# EAGLE board zx80 SD_12 (smd) build003 (EAGLE 9.6.2), part 1 of 2
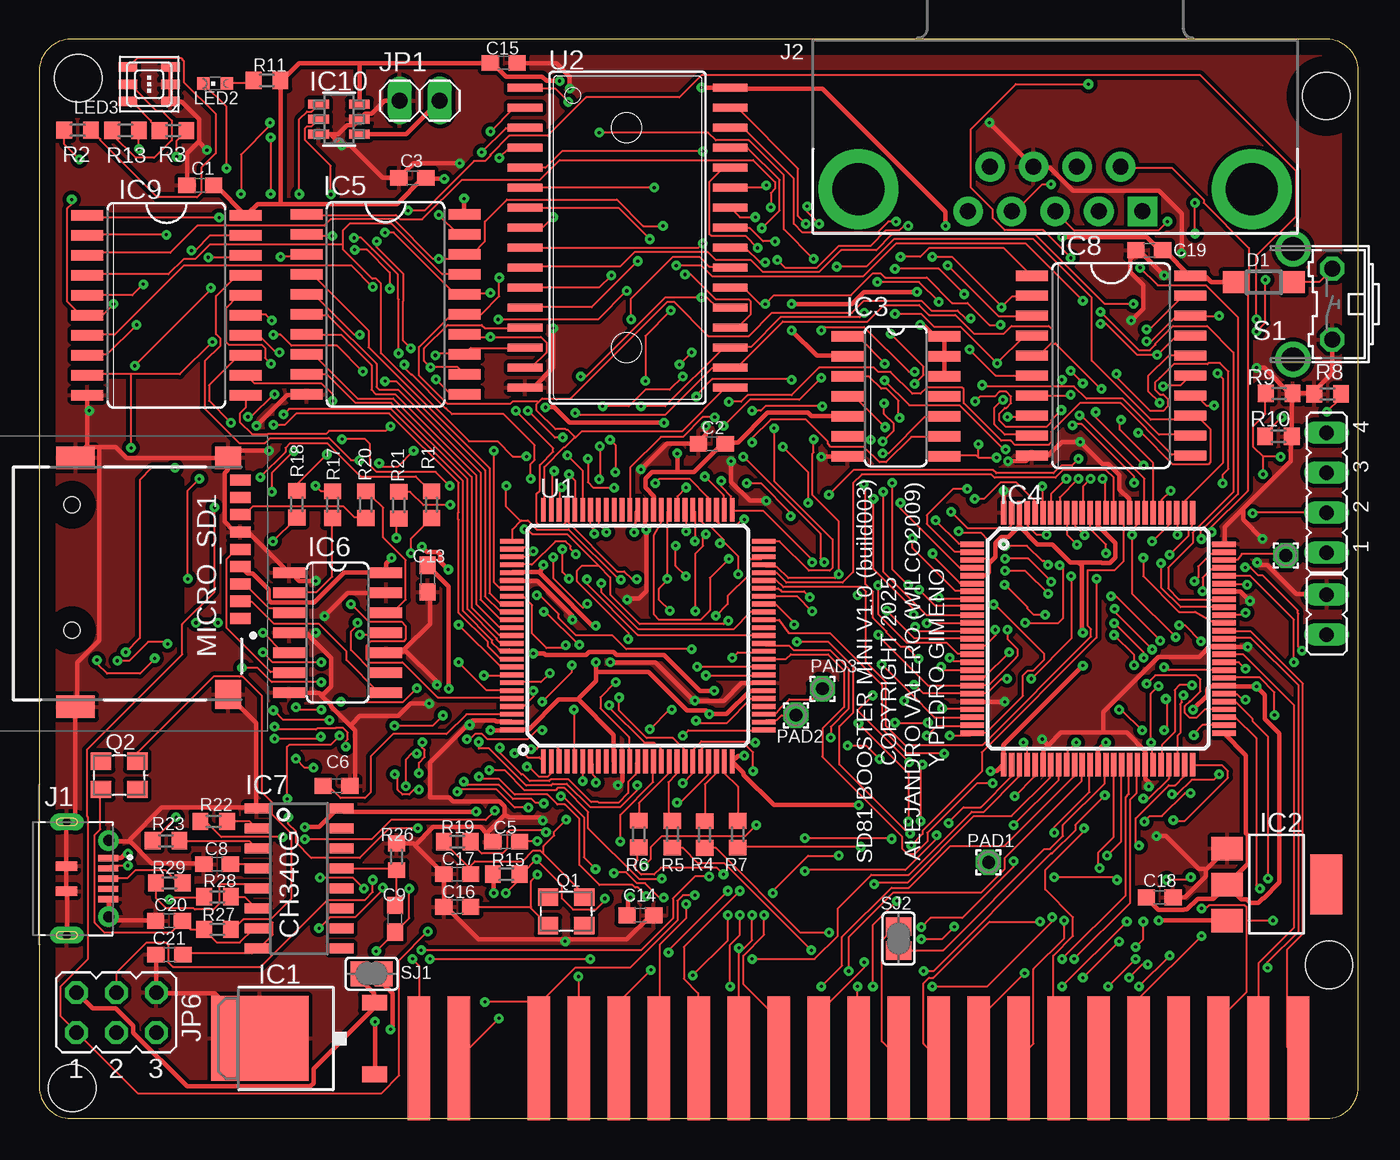
[diagram p3: board, top side]
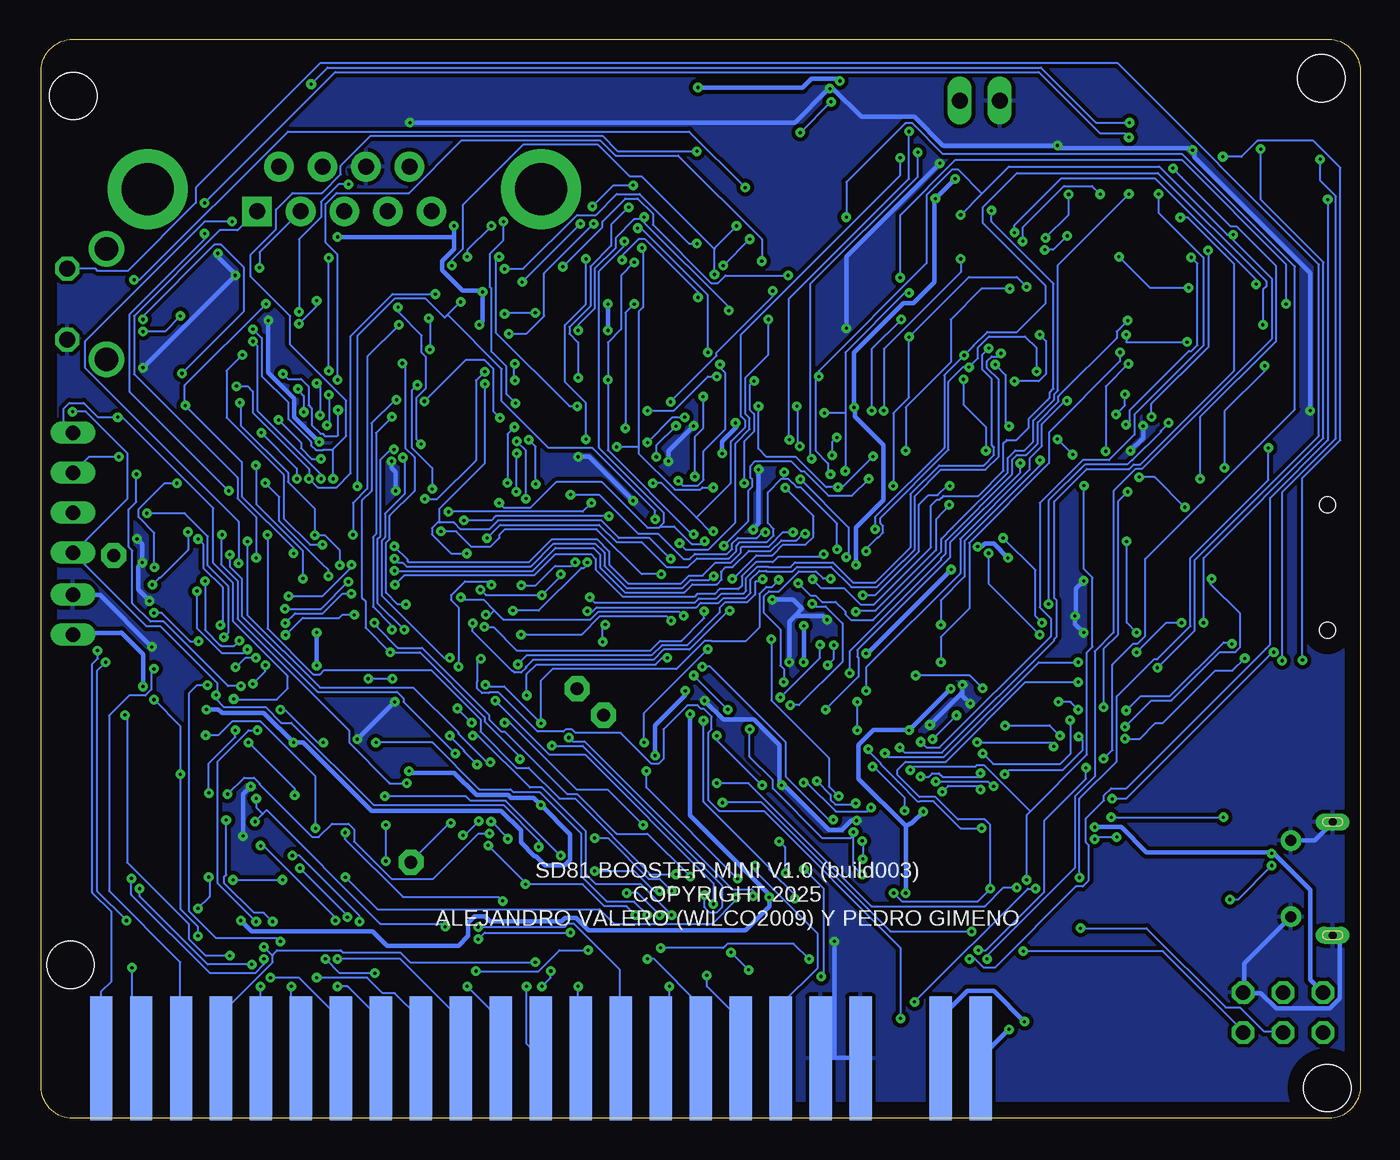
[diagram p4: board, bottom side, seen from below]

Size 83.82 x 68.58 mm. Coordinates in mm from the lower left corner, seen from the top.
Outline: 2,0 81.82,0 arc90 83.82,2 83.82,66.58 arc90 81.82,68.58 2,68.58 arc90 0,66.58 0,2 arc90 2,0
Copper layers (1*16): Top 0.035mm / dielectric 1.5mm / Bottom 0.035mm
Design rules "default *": minimum track width 5mil, minimum drill 0.2mm, track to track 6mil, track to pad 6mil, pad to pad 6mil, via to via 6mil, smd to smd 6mil, copper to edge 40mil, drill to drill 6mil, minimum pad ring 10mil, minimum via ring 8mil, stop-mask expansion 4mil, vias tented up to drill 999mil, thermal gap 10mil
Net classes: 1 VCC: width 0.3 mm; 2 3,3: width 0.3 mm
Holes 3 mm at 2.09,1.93 2.46,66.1 81.79,64.98 81.96,9.75

## Footprints (pad centres in the part's own frame; a part is rotated, then mirrored left to right if it is on the bottom)
EDGEPIN = smd 1.422 x 7.874: 1 0,0
C0603 = smd 1.1 x 1: 1 -0.85,0; 2 0.85,0
SOD123 = smd 1.4 x 1.4: A 1.9,0; C -1.9,0
TO252 = smd 1 x 1.6: 1 -2.28,-4.8; 2 2.28,-4.8 | smd 5.4 x 6.2: 3 0,2.5
SOT223 = smd 1.499 x 2.007: 1 -2.261,-3.15; 2 0.025,-3.15; 3 2.311,-3.15 | smd 3.81 x 2.007: 4 0,3.15
SO14 = smd 0.66 x 2.032: 1 -3.81,-3.073; 2 -2.54,-3.073; 3 -1.27,-3.073; 4 0,-3.073; 5 1.27,-3.073; 6 2.54,-3.073; 7 3.81,-3.073; 8 3.81,3.073; 9 2.54,3.073; 10 1.27,3.073; 11 0,3.073; 12 -1.27,3.073; 13 -2.54,3.073; 14 -3.81,3.073
TQFP100 = smd 1.5 x 0.345: 1 -8,6; 2 -8,5.5; 3 -8,5; 4 -8,4.5; 5 -8,4; 6 -8,3.5; 7 -8,3; 8 -8,2.5; 9 -8,2; 10 -8,1.5; 11 -8,1; 12 -8,0.5; 13 -8,0; 14 -8,-0.5; 15 -8,-1; 16 -8,-1.5; 17 -8,-2; 18 -8,-2.5; 19 -8,-3; 20 -8,-3.5; 21 -8,-4; 22 -8,-4.5; 23 -8,-5; 24 -8,-5.5; 25 -8,-6; 51 8,-6; 52 8,-5.5; 53 8,-5; 54 8,-4.5; 55 8,-4; 56 8,-3.5; 57 8,-3; 58 8,-2.5; 59 8,-2; 60 8,-1.5; 61 8,-1; 62 8,-0.5; 63 8,0; 64 8,0.5; 65 8,1; 66 8,1.5; 67 8,2; 68 8,2.5; 69 8,3; 70 8,3.5; 71 8,4; 72 8,4.5; 73 8,5; 74 8,5.5; 75 8,6 | smd 0.345 x 1.5: 26 -6,-8; 27 -5.5,-8; 28 -5,-8; 29 -4.5,-8; 30 -4,-8; 31 -3.5,-8; 32 -3,-8; 33 -2.5,-8; 34 -2,-8; 35 -1.5,-8; 36 -1,-8; 37 -0.5,-8; 38 0,-8; 39 0.5,-8; 40 1,-8; 41 1.5,-8; 42 2,-8; 43 2.5,-8; 44 3,-8; 45 3.5,-8; 46 4,-8; 47 4.5,-8; 48 5,-8; 49 5.5,-8; 50 6,-8; 76 6,8; 77 5.5,8; 78 5,8; 79 4.5,8; 80 4,8; 81 3.5,8; 82 3,8; 83 2.5,8; 84 2,8; 85 1.5,8; 86 1,8; 87 0.5,8; 88 0,8; 89 -0.5,8; 90 -1,8; 91 -1.5,8; 92 -2,8; 93 -2.5,8; 94 -3,8; 95 -3.5,8; 96 -4,8; 97 -4.5,8; 98 -5,8; 99 -5.5,8; 100 -6,8
SO20W = smd 0.66 x 2.032: 1 -5.715,-5.029; 2 -4.445,-5.029; 3 -3.175,-5.029; 4 -1.905,-5.029; 5 -0.635,-5.029; 6 0.635,-5.029; 7 1.905,-5.029; 8 3.175,-5.029; 9 4.445,-5.029; 10 5.715,-5.029; 11 5.715,5.029; 12 4.445,5.029; 13 3.175,5.029; 14 1.905,5.029; 15 0.635,5.029; 16 -0.635,5.029; 17 -1.905,5.029; 18 -3.175,5.029; 19 -4.445,5.029; 20 -5.715,5.029
SOIC16 = smd 0.635 x 1.524: 1 -4.445,-2.695; 2 -3.175,-2.695; 3 -1.905,-2.695; 4 -0.635,-2.695; 5 0.635,-2.695; 6 1.905,-2.695; 7 3.175,-2.695; 8 4.445,-2.695; 9 4.445,2.695; 10 3.175,2.695; 11 1.905,2.695; 12 0.635,2.695; 13 -0.635,2.695; 14 -1.905,2.695; 15 -3.175,2.695; 16 -4.445,2.695
SOT-23-6_MC = smd 1.321 x 0.559: 1 -1.295,0.95; 2 -1.295,0; 3 -1.295,-0.95; 4 1.295,-0.95; 5 1.295,0; 6 1.295,0.95
SHOUHAN_MICROXNJ = smd 0.4 x 1.25: 1 1.3,-4.375; 2 0.65,-4.375; 3 0,-4.375; 4 -0.65,-4.375; 5 -1.3,-4.375 | smd 0.6 x 1.35: S1 -0.8,-1.725; S2 0.8,-1.725 | drill 0.5 pad 1.07 long: S3 -3.6,-1.75; S6 3.6,-1.75 | drill 0.7 pad 1.3: S4 -2.425,-4.4; S5 2.425,-4.4
DB9_MALE = drill 1.016 pad 1.88 square: 1 5.54,-1.42 | drill 1.016 pad 1.88: 2 2.77,-1.42; 3 0,-1.42; 4 -2.77,-1.42; 5 -5.54,-1.42; 6 4.15,1.42; 7 1.38,1.42; 8 -1.38,1.42; 9 -4.15,1.42 | drill 3.302 pad 5.08: G1 -12.5,0; G2 12.5,0
1X02 = drill 1.016 long: 1 -1.27,0; 2 1.27,0
JP1 = drill 0.914 long: 1 0,-1.27; 2 0,1.27
JP4 = drill 0.914 long: 1 -3.81,0; 2 -1.27,0; 3 1.27,0; 4 3.81,0
JP3Q = drill 0.914 octagon: 1 -2.54,-1.27; 2 -2.54,1.27; 3 0,-1.27; 4 0,1.27; 5 2.54,-1.27; 6 2.54,1.27
CHIPLED_0603 = smd 0.8 x 0.8: A 0,-0.75; C 0,0.75
3535-PLCC6 = smd 1.2 x 0.6: P1 1.35,-1.1; P2 1.35,0; P3 1.35,1.1; P4 -1.35,1.1; P5 -1.35,0; P6 -1.35,-1.1
TF-01A = smd 0.7 x 1.3: 1 2.23,7.174; 2 1.13,7.174; 3 0.03,7.174; 4 -1.07,7.174; 5 -2.17,7.174; 6 -3.27,7.174; 7 -4.37,7.174; 8 -5.47,7.174; CD1 -6.57,7.174 | smd 1.448 x 1.651: MP1 -7.989,6.4 | smd 1.448 x 2.438: MP2 -7.989,-3.3; MP3 7.836,-3.3 | smd 1.854 x 1.651: MP4 7.061,6.4 | hole 1: -5.004,-3.531; 2.972,-3.531
1,6/0,8 = drill 0.813 pad 1.6 octagon: 1 0,0
3.2X2.5_KX-7 = smd 1.3 x 1.1: 1 -1.15,-0.9; 2 1.15,-0.9; 3 1.15,0.9; 4 -1.15,0.9
R0603 = smd 1 x 1.1: 1 -0.85,0; 2 0.85,0
B3F-31XX = drill 1.016 octagon: 1 -2.261,-1.245; 2 2.261,-1.245 | drill 1.499 pad 2.159: 3 -3.505,1.245; 4 3.505,1.245
SJ = smd 1.168 x 1.6: 1 -0.762,0; 2 0.762,0
TQFP100' = smd 1.5 x 0.3: 1 -8,6; 2 -8,5.5; 3 -8,5; 4 -8,4.5; 5 -8,4; 6 -8,3.5; 7 -8,3; 8 -8,2.5; 9 -8,2; 10 -8,1.5; 11 -8,1; 12 -8,0.5; 13 -8,0; 14 -8,-0.5; 15 -8,-1; 16 -8,-1.5; 17 -8,-2; 18 -8,-2.5; 19 -8,-3; 20 -8,-3.5; 21 -8,-4; 22 -8,-4.5; 23 -8,-5; 24 -8,-5.5; 25 -8,-6; 51 8,-6; 52 8,-5.5; 53 8,-5; 54 8,-4.5; 55 8,-4; 56 8,-3.5; 57 8,-3; 58 8,-2.5; 59 8,-2; 60 8,-1.5; 61 8,-1; 62 8,-0.5; 63 8,0; 64 8,0.5; 65 8,1; 66 8,1.5; 67 8,2; 68 8,2.5; 69 8,3; 70 8,3.5; 71 8,4; 72 8,4.5; 73 8,5; 74 8,5.5; 75 8,6 | smd 0.3 x 1.5: 26 -6,-8; 27 -5.5,-8; 28 -5,-8; 29 -4.5,-8; 30 -4,-8; 31 -3.5,-8; 32 -3,-8; 33 -2.5,-8; 34 -2,-8; 35 -1.5,-8; 36 -1,-8; 37 -0.5,-8; 38 0,-8; 39 0.5,-8; 40 1,-8; 41 1.5,-8; 42 2,-8; 43 2.5,-8; 44 3,-8; 45 3.5,-8; 46 4,-8; 47 4.5,-8; 48 5,-8; 49 5.5,-8; 50 6,-8; 76 6,8; 77 5.5,8; 78 5,8; 79 4.5,8; 80 4,8; 81 3.5,8; 82 3,8; 83 2.5,8; 84 2,8; 85 1.5,8; 86 1,8; 87 0.5,8; 88 0,8; 89 -0.5,8; 90 -1,8; 91 -1.5,8; 92 -2,8; 93 -2.5,8; 94 -3,8; 95 -3.5,8; 96 -4,8; 97 -4.5,8; 98 -5,8; 99 -5.5,8; 100 -6,8
SOP32-5 = smd 2.2 x 0.5: 1 -6.516,9.525; 2 -6.516,8.255; 3 -6.516,6.985; 4 -6.516,5.715; 5 -6.516,4.445; 6 -6.516,3.175; 7 -6.516,1.905; 8 -6.516,0.635; 9 -6.516,-0.635; 10 -6.516,-1.905; 11 -6.516,-3.175; 12 -6.516,-4.445; 13 -6.516,-5.715; 14 -6.516,-6.985; 15 -6.516,-8.255; 16 -6.516,-9.525; 17 6.516,-9.525; 18 6.516,-8.255; 19 6.516,-6.985; 20 6.516,-5.715; 21 6.516,-4.445; 22 6.516,-3.175; 23 6.516,-1.905; 24 6.516,-0.635; 25 6.516,0.635; 26 6.516,1.905; 27 6.516,3.175; 28 6.516,4.445; 29 6.516,5.715; 30 6.516,6.985; 31 6.516,8.255; 32 6.516,9.525

## Placement (x,y rotation side)
1A  D7  [EDGEPIN]  24.13,3.81 0 top
1B  VCC  [EDGEPIN]  24.13,3.81 180 bottom
2A  /RAMCS  [EDGEPIN]  26.67,3.81 0 top
2B  9V  [EDGEPIN]  26.67,3.81 180 bottom
4A  D0  [EDGEPIN]  31.75,3.81 0 top
4B  GND  [EDGEPIN]  31.75,3.81 180 bottom
5A  D1  [EDGEPIN]  34.29,3.81 0 top
5B  GND  [EDGEPIN]  34.29,3.81 180 bottom
6A  D2  [EDGEPIN]  36.83,3.81 0 top
6B  /CLOCK  [EDGEPIN]  36.83,3.81 180 bottom
7A  D6  [EDGEPIN]  39.37,3.81 0 top
7B  A0  [EDGEPIN]  39.37,3.81 180 bottom
8A  D5  [EDGEPIN]  41.91,3.81 0 top
8B  A1  [EDGEPIN]  41.91,3.81 180 bottom
9A  D3  [EDGEPIN]  44.45,3.81 0 top
9B  A2  [EDGEPIN]  44.45,3.81 180 bottom
10A  D4  [EDGEPIN]  46.99,3.81 0 top
10B  A3  [EDGEPIN]  46.99,3.81 180 bottom
11A  A6  [EDGEPIN]  49.53,3.81 0 top
11B  A15  [EDGEPIN]  49.53,3.81 180 bottom
12A  /NMI  [EDGEPIN]  52.07,3.81 0 top
12B  A14  [EDGEPIN]  52.07,3.81 180 bottom
13A  /HALT  [EDGEPIN]  54.61,3.81 0 top
13B  A13  [EDGEPIN]  54.61,3.81 180 bottom
14A  /MREQ  [EDGEPIN]  57.15,3.81 0 top
14B  A12  [EDGEPIN]  57.15,3.81 180 bottom
15A  /IORQ  [EDGEPIN]  59.69,3.81 0 top
15B  A11  [EDGEPIN]  59.69,3.81 180 bottom
16A  /RD  [EDGEPIN]  62.23,3.81 0 top
16B  A10  [EDGEPIN]  62.23,3.81 180 bottom
17A  /WR  [EDGEPIN]  64.77,3.81 0 top
17B  A9  [EDGEPIN]  64.77,3.81 180 bottom
18A  /BUSAK  [EDGEPIN]  67.31,3.81 0 top
18B  A8  [EDGEPIN]  67.31,3.81 180 bottom
19A  /WAIT  [EDGEPIN]  69.85,3.81 0 top
19B  A7  [EDGEPIN]  69.85,3.81 180 bottom
20A  /BUSRQ  [EDGEPIN]  72.39,3.81 0 top
20B  A6  [EDGEPIN]  72.39,3.81 180 bottom
21A  /RESET  [EDGEPIN]  74.93,3.81 0 top
21B  A5  [EDGEPIN]  74.93,3.81 180 bottom
22A  /M1  [EDGEPIN]  77.47,3.81 0 top
22B  A4  [EDGEPIN]  77.47,3.81 180 bottom
23A  /RFSH  [EDGEPIN]  80.01,3.81 0 top
23B  /ROMCS  [EDGEPIN]  80.01,3.81 180 bottom
C1  100nF  [C0603]  10.23,59.3 180 top
C2  100nF  [C0603]  42.74,42.88 180 top
C3  100nF  [C0603]  23.71,59.77 180 top
C5  22pF  [C0603]  29.67,17.58 0 top
C6  0.1uF  [C0603]  18.89,21.13 0 top
C8  0.1uF  [C0603]  11.3,16.16 0 top
C9  100nF  [C0603]  22.61,12.69 90 top
C13  0.1uF  [C0603]  24.68,34.3 270 top
C14  0.1uF  [C0603]  38.2,12.9 0 top
C15  100nF  [C0603]  29.51,67.09 0 top
C16  22pF  [C0603]  26.56,13.44 0 top
C17  22pF  [C0603]  26.55,15.53 0 top
C18  100nF  [C0603]  71.2,14.04 0 top
C19  100nF  [C0603]  70.54,55.18 180 top
C20  22pF  [C0603]  8.24,12.56 0 top
C21  22pF  [C0603]  8.27,10.41 0 top
D1  [SOD123]  77.81,53.14 0 top
IC1  7805DT  [TO252]  16.51,5.08 90 top
IC2  REG1117  [SOT223]  78.64,14.89 270 top
IC3  74ACT125D  [SO14]  54.43,45.89 270 top
IC4  XC95144XL-10TQG100C  [TQFP100]  67.28,30.49 0 top
IC5  74HC573D  [SO20W]  22.01,51.73 270 top
IC6  74LVC125  [SO14]  18.96,30.87 270 top
IC7  CH340G  [SOIC16]  16.51,15.24 270 top
IC8  74HC573D  [SO20W]  68.11,47.84 270 top
IC9  74HC573D  [SO20W]  8.08,51.68 270 top
IC10  MCP4725  [SOT-23-6_MC]  19.05,63.5 180 top
J1  MICROXNJ (C404969)  [SHOUHAN_MICROXNJ]  0,15.24 90 top
J2  JOYSTICK  [DB9_MALE]  64.57,59.07 0 top
JP1  [1X02]  24.18,64.69 0 top
JP2  [JP1]  81.81,32.02 0 top
JP3  JTAG  [JP4]  81.81,39.76 90 top
JP6  ICSP  [JP3Q]  4.89,6.73 0 top
LED2  SD  [CHIPLED_0603]  11.18,65.77 90 top
LED3  STATUS  [3535-PLCC6]  6.98,65.73 0 top
MICRO_SD1  TF-01A  [TF-01A]  5.6,34 270 top
PAD1  [1,6/0,8]  60.33,16.28 0 top
PAD2  [1,6/0,8]  48.08,25.62 0 top
PAD3  [1,6/0,8]  49.76,27.31 0 top
PAD6  P73  [1,6/0,8]  79.22,35.78 0 top
Q1  16MHz  [3.2X2.5_KX-7]  33.48,13.16 180 top
Q2  12MHz  [3.2X2.5_KX-7]  5.08,21.81 180 top
R1  0R  [R0603]  24.93,39.01 270 top
R2  150  [R0603]  2.44,62.8 0 top
R3  68  [R0603]  8.51,62.78 180 top
R4  180  [R0603]  42.28,18.04 270 top
R5  180  [R0603]  40.23,18.06 270 top
R6  100  [R0603]  38.1,18.08 270 top
R7  180  [R0603]  44.39,18.05 270 top
R8  330  [R0603]  81.87,46.04 0 top
R9  330  [R0603]  78.8,46.07 180 top
R10  330  [R0603]  78.74,43.35 180 top
R11  680  [R0603]  14.47,65.97 180 top
R13  150  [R0603]  5.48,62.78 180 top
R15  [R0603]  29.67,15.53 180 top
R17  3k3  [R0603]  18.65,39.01 270 top
R18  3k3  [R0603]  16.37,39.04 270 top
R19  1M  [R0603]  26.56,17.59 0 top
R20  3k3  [R0603]  20.75,39.01 270 top
R21  3k3  [R0603]  22.84,38.97 270 top
R22  1K  [R0603]  11.08,18.87 0 top
R23  1K  [R0603]  8.05,17.64 0 top
R26  1K  [R0603]  22.7,16.63 90 top
R27  1M  [R0603]  11.33,12.01 180 top
R28  22R  [R0603]  11.33,14.09 180 top
R29  22R  [R0603]  8.26,14.97 0 top
S1  RESET  [B3F-31XX]  80.93,51.76 90 top
SJ1  POWER_5V  [SJ]  21.12,9.19 180 top
SJ2  MC45  [SJ]  54.61,11.43 90 top
U1  ATMEGA2560AU  [TQFP100']  38.03,30.69 90 top
U2  AS6C4008  [SOP32-5]  37.38,55.97 0 top

## Tracks (layer width: path | path; a pad name or v marks a point on that pad's centre or on a via)
3V3  (via drill 0.2)
  Top 0.3: IC4.51 76.69,23.08 76.69,18.13 76.8,18.02 76.8,16.14 76.77,16.14 IC2.2 75.49,14.83 | 75.49,14.83 74.61,13.95 73.61,13.95 72.94,13.27 72.76,13.27 72.72,13.24 71.1,13.24 70.37,13.97 70.37,14.02 C18.1 | 75.49,14.83 76.4,13.92 76.74,13.92 76.96,13.7 77.47,13.7 77.77,13.99 77.82,13.99 78.82,14.99 78.82,24.46 77.89,25.38 77.89,26.91 v77.36,27.45 76.17,27.45 76.16,27.46 75.31,27.46 IC4.57 75.26,27.46 74.41,27.46 74.23,27.29 74.23,26.89 v73.32,25.98 | IC4.5 59.31,34.51 60.16,34.51 60.33,34.69 60.33,35.27 60.76,35.69 60.76,36.58 61.14,36.95 61.6,36.95 62.28,37.64 | 66.04,35.34 65.51,35.34 64.37,36.48 63.44,36.48 62.28,37.64 | 66.04,35.34 67.49,35.34 67.53,35.3 68.04,35.3 68.39,35.65 68.39,36.58 67.54,37.44 67.48,37.44 67.28,37.64 IC4.88 | v66.32,30.87 66.32,31.09 66.26,31.15 66.26,35.12 66.04,35.34 | 62.28,37.64 IC4.98 62.28,37.64 | v22.38,35.62 22.03,35.27 IC6.14 19.38,34.68 17.47,32.78 14.74,32.78 14.57,32.96 14.57,33.6 13.55,34.62 13.22,34.62 MICRO_SD1.4 | v24.31,36.34 24.65,36 25.3,36 25.48,35.83 25.48,35.39 v25.98,34.88 | v44.81,23.05 44.39,23.05 U1.25 44.76,21.96 44.76,21.82 46.67,19.91 v52.07,19.91 | IC4.38 67.28,23.39 v67.79,23.89 | v60.45,22.07 60.87,22.07 IC4.26 61.28,23.74 v66.32,28.78 | v42.9,27.17 41.98,27.17 39.69,29.46 36.67,29.46 36.5,29.63 34.93,29.63 34.76,29.45 32.16,29.45 32.06,29.55 v31.39,29.55
  Bottom 0.3: v66.32,30.87 v66.32,28.78 | v24.31,36.34 24.05,36.34 23.86,36.52 23.28,36.52 v22.38,35.62 | v60.45,22.07 60.34,21.96 57.58,21.96 56.17,20.55 54.15,20.55 53.96,20.36 52.53,20.36 v52.07,19.91 50.21,18.04 50.21,16.44 50.56,16.09 51.81,16.09 52.37,16.65 52.46,16.65 53.34,17.53 53.34,18.29 54.59,19.54 62.84,19.54 67.19,23.89 v67.79,23.89 68.68,24.78 68.72,24.78 69.69,25.76 72.34,25.76 72.56,25.98 v73.32,25.98 | v25.98,34.88 31.32,29.55 v31.39,29.55 | v42.9,27.17 42.9,26.88 44.81,24.97 v44.81,23.05 | JP2.1 81.69,30.86 78.73,30.86 78.73,30.87 77.36,29.49 v77.36,27.45
5V  (via drill 0.2)
  Top 0.3: v22.31,5.66 22.45,5.8 22.45,7.96 21.9,8.52 21.9,9.15 SJ1.1
  Bottom 0.3: v22.31,5.66 24.13,3.84 1B.1
9V  (via drill 0.2)
  Top 0.3: v21.34,6.15 21.34,2.86 IC1.1
  Bottom 0.3: v21.34,6.15 23.29,8.1 24.97,8.1 26.65,6.43 26.65,3.84 2B.1
74573_OC  (via drill 0.2)
  Top 0.127: v36.21,26.26 36.21,26.12 38.45,23.89 39.08,23.89 39.5,23.47 39.5,22.7 U1.16 | v34.83,32.7 34.56,32.44 32.65,34.35 v32.65,35.67 | v35.62,42.72 35.62,40.62 v35.58,40.62 | v35.8,45.26 37.47,45.26 38.52,46.31 40.06,46.31 v40.89,47.15 | v45.3,44.98 45.85,44.98 46.13,45.26 v49.77,45.26 | v54.72,54.76 55.98,54.76 56.54,55.32 61.29,55.32 63.04,53.58 IC8.1
  Bottom 0.127: v36.21,26.26 35.66,26.26 32.9,29.02 32.9,31.46 33.98,32.54 34.66,32.54 v34.83,32.7 | v32.65,35.67 32.51,35.81 32.51,37.56 v35.58,40.62 | v35.8,45.26 35.75,45.21 35.75,42.84 v35.62,42.72 | v40.89,47.15 41.45,47.15 43.62,44.98 v45.3,44.98 | v49.77,45.26 50.25,45.26 54.93,49.94 54.93,54.55 v54.72,54.76
/CLOCK  (via drill 0.2)
  Top 0.127: v57.38,26.05 59.27,26.05 IC4.22 | v54.38,25.15 v56.47,25.15 | v45.57,18.65 44.88,17.95 39.57,17.95 38.87,17.25 38.87,16.48 v38.45,16.07
  Bottom 0.127: v56.47,25.15 v57.38,26.05 | v54.38,25.15 54.03,25.15 49.77,20.89 47.81,20.89 v45.57,18.65 | v38.45,16.07 38.45,15.72 34.47,11.73 34.47,9.57 36.77,7.26 36.77,3.84 6B.1
/HALT
  Top 0.127: SJ2.2 54.58,12.15 54.38,12.15 53.54,11.32 53.54,4.89 54.58,3.84 13A.1
/IORQ  (via drill 0.2)
  Top 0.127: v65.76,10.13 69.32,13.69 69.32,20.26 69.74,20.68 69.74,22.42 IC4.43 | v62.62,9.22 59.75,6.36 59.75,3.84 15A.1
  Bottom 0.127: v65.76,10.13 64.85,9.22 v62.62,9.22
/M1
  Top 0.127: IC4.61 75.33,29.48 76.52,29.48 79.75,26.24 79.75,12.14 77.5,9.88 77.5,3.84 22A.1
/MEM_CE  (via drill 0.2)
  Top 0.127: v46.69,43.87 46.69,40.51 50.41,36.79 50.41,34.98 50.25,34.82 48.9,34.82 47.04,36.67 46.06,36.67 U1.50 | U2.22 43.97,52.74 44.81,52.74 45.78,51.76 v46.13,51.76 46.69,52.32 51.58,52.32 52.98,53.72 53.47,53.72 53.75,53.44 56.4,53.44 58.01,51.83 58.98,51.83 60.38,50.43 v61.08,50.43 | v64.01,37.09 63.39,37.09 62.83,37.65 62.83,38.49 IC4.97
  Bottom 0.127: v46.69,43.87 46.69,51.2 v46.13,51.76 | v64.01,37.09 64.01,39.12 63.11,40.02 63.11,48.41 v61.08,50.43
/MEM_OE  (via drill 0.2)
  Top 0.127: IC4.12 59.24,30.94 55.94,30.94 55.67,31.22 v55.67,31.24 | v46.13,54.41 45.78,54.41 44.88,55.32 43.97,55.32 U2.24 | v42.29,40.79 43.48,39.6 43.48,38.7 U1.52 | v41.75,45.88 41.75,45.97 42.76,46.97 47.78,46.97 v47.81,46.94 | v41.69,32.24 41.69,35.9 42.18,36.39 42.18,36.94 42.34,37.1 42.34,37.11 v42.36,37.13
  Bottom 0.127: v55.67,31.24 55.65,31.22 55.09,31.22 53.6,29.73 45.11,29.73 44.49,30.34 43.14,30.34 41.82,31.66 41.69,31.79 v41.69,32.24 | v42.36,37.13 42.39,37.13 42.44,37.18 42.52,37.18 47.81,42.47 v47.81,46.94 47.81,49.31 46.97,50.15 46.97,53.58 v46.13,54.41 | v42.29,40.79 42.29,43.31 41.75,43.84 v41.75,45.88
/MREQ  (via drill 0.2)
  Top 0.127: v67.86,16.69 68.76,17.6 68.76,22.42 IC4.41 | v63.59,12.5 60.38,12.5 56.82,8.94 56.54,8.94 56.19,8.59 56.19,4.75 57.1,3.84 14A.1
  Bottom 0.127: v67.86,16.69 67.81,16.74 67.47,16.74 63.59,12.87 v63.59,12.5
/NMI  (via drill 0.2)
  Top 0.127: v51.44,9.36 51.44,11.53 54.28,14.36 59.86,14.36 61.36,15.86 61.36,16.55 66.25,21.44 66.25,22.42 IC4.36 | v52,8.38 52,3.91 52.07,3.84 12A.1
  Bottom 0.127: v51.44,9.36 51.44,8.94 v52,8.38
/OE_CTRL_CLOCK  (via drill 0.2)
  Top 0.127: v53.64,39.84 53.63,39.82 53.63,34.75 56.39,31.99 59.27,31.99 IC4.10 | v53.61,42.26 53.96,42.26 56.26,44.56 57.45,44.56 IC3.10
  Bottom 0.127: v53.61,42.26 53.64,42.22 v53.64,39.84
/OE_IL  (via drill 0.2)
  Top 0.127: v53.31,33.88 | v53.31,33.88 53.31,32.04 55.11,30.25 57.66,30.25 58.36,29.55 59.27,29.55 IC4.15 | v49.89,35.35 49.63,35.61 49.63,37.16 v44.74,42.05 | v43.48,44.01 45.16,45.68 48.3,45.68 v49.69,47.08 | v46.48,57.91 46.48,58.81 46.76,59.09 46.76,59.51 45.36,60.91 33.07,60.91 31.81,59.65 26.85,59.65 24.34,57.14 22.94,57.14 22.66,57.42 17.01,57.42 IC5.1
  Bottom 0.127: v53.31,33.88 52.39,33.88 51.15,35.12 50.12,35.12 v49.89,35.35 | v44.74,42.05 44.74,42.75 v43.48,44.01 | v49.69,47.08 49.69,49.31 50.25,49.87 50.25,50.29 48.93,51.62 48.93,54.13 47.6,55.46 47.6,56.79 v46.48,57.91
/OE_RAMCS  (via drill 0.2)
  Top 0.127: v57.31,28.71 57.52,28.5 59.27,28.5 IC4.17 | v54.2,40.39 54.19,40.38 54.19,34.92 v55.2,33.91 | v53.75,43.94 51.86,45.82 51.37,45.82 IC3.4
  Bottom 0.127: v57.31,28.71 57.31,32.48 57.78,32.95 57.78,33.24 56.89,34.13 55.42,34.13 v55.2,33.92 v55.2,33.91 | v54.2,40.39 54.2,43.48 v53.75,43.94
/OE_ROMCS  (via drill 0.2)
  Top 0.127: v60.75,31.06 60.75,30.68 60.1,30.04 59.33,30.04 IC4.14 | v61.41,42.51 61.29,42.51 58.48,45.32 55.29,45.32 v53.72,46.9 | v53.72,47.96 53.72,48.02 52.08,49.66 51.37,49.66 IC3.1
  Bottom 0.127: v61.41,42.51 61.62,42.51 62.27,41.86 62.27,37.02 62.46,36.83 62.46,32.77 v60.75,31.06 | v53.72,46.9 53.82,46.9 53.82,47.87 v53.72,47.96
/RAMCS  (via drill 0.2)
  Top 0.127: 2A.1 v29.21,6.35 | v55.88,29.21 55.12,29.97 54.75,29.97 53.85,30.87 53.85,30.95 52.98,31.82 52.98,33.47 52.49,33.96 52.49,40.22 v52.4,40.31 | v52.85,43.14 51.56,43.14 IC3.6
  Bottom 0.127: v29.21,6.35 29.21,10.83 37.91,19.53 40.75,19.53 40.75,19.55 41.41,20.22 41.41,24.52 41.21,24.72 41.21,25.54 41.7,26.02 41.88,26.02 42.1,26.25 42.76,26.25 44.29,24.72 44.29,22.84 44.59,22.53 45.02,22.53 46.99,24.5 49.86,24.5 50.08,24.72 50.51,24.72 50.64,24.59 52.27,24.59 54.75,27.07 55.36,27.07 55.39,27.03 55.82,27.03 56.12,27.34 56.12,27.77 56.08,27.81 56.08,29.01 v55.88,29.21 | v52.4,40.31 52.4,42.69 v52.85,43.14
/RD  (via drill 0.2)
  Top 0.127: v69.88,17.32 69.67,17.53 69.67,19.07 71.77,21.16 72.19,21.16 72.75,21.72 72.75,22.42 IC4.49 | v65.13,12.57 65.13,11.46 63.18,9.5 63.18,4.75 62.27,3.84 16A.1
  Bottom 0.127: v65.13,12.57 65.13,12.78 69.67,17.32 v69.88,17.32
/RESET  (via drill 0.2)
  Top 0.127: v36.92,17.6 36.92,19.29 39.01,21.37 39.01,22.63 U1.15 | v68.48,15.16 68.32,15.32 v64.49,15.32 | v71.63,15.16 73.18,15.16 v73.18,15.34 | v73.86,13.34 74.14,13.34 74.35,13.55 76.59,13.55 76.73,13.41 76.73,12.57 | 76.73,12.57 76.73,8.03 74.98,6.29 74.98,3.84 21A.1 | v79.73,28.99 79.73,31.69 76.96,34.46 75.31,34.46 IC4.71 | 76.73,12.57 v78.4,12.57 | v39.69,14.02 39.42,14.02 38.5,14.95 37.98,14.95 37.3,15.64 36.56,15.64 v36.52,15.59
  Bottom 0.127: v36.52,15.59 36.57,15.65 36.57,17.25 v36.92,17.6 | v39.69,14.02 39.69,13.85 41.17,12.36 47.41,12.36 48.33,13.29 62.45,13.29 v64.49,15.32 | v71.63,15.16 v68.48,15.16 | v73.18,15.34 73.12,15.28 73.12,14.08 v73.86,13.34 | v79.73,28.99 80.29,28.43 80.29,14.46 v78.4,12.57
/RFSH
  Top 0.127: IC4.64 75.33,30.94 77.01,30.94 80.31,27.64 80.31,11.74 79.32,10.75 79.32,4.53 80.01,3.84 23A.1
/ROMCS  (via drill 0.2)
  Top 0.127: v80.25,29.73 80.01,29.97 80.01,32.07 79.99,32.09 79.99,32.28 77.75,34.52 77.47,34.52 76.97,35.01 v76.64,35.01 | v75.2,40.37 75.2,40.91 75.56,41.27 75.56,47.47 75.02,48.02 74.33,48.02 74.24,47.93 72.09,47.93 71.22,47.06 71.2,47.06 70.9,46.75 70.9,46.32 71.21,46.01 71.42,46.01 71.72,45.7 71.72,45.27 71.42,44.97 70.6,44.97 68.46,47.11 v68.46,47.31 | v64.95,45.02 64.31,44.38 64.31,44.25 64.01,43.94 61.43,43.94 61.01,44.36 61.01,44.79 61.36,45.15 61.45,45.15 61.76,45.45 61.76,45.88 61.45,46.18 61.02,46.18 60.71,45.88 59.78,45.88 v59.47,45.57 | v54.67,44.51 54.61,44.58 54.61,45.61 53.84,46.38 53.5,46.38 52.73,47.16 IC3.3
  Bottom 0.127: 23B.1 80.01,8.06 79.34,8.72 79.34,13.12 80.57,14.35 80.57,28.88 80.22,29.23 80.22,29.71 v80.25,29.73 | v76.64,35.01 76.64,37.22 77.63,38.21 77.63,38.72 75.99,40.37 v75.2,40.37 | v68.46,47.31 68.14,46.99 67.31,46.99 66.84,46.52 66.84,45.32 66.62,45.1 66.62,44.06 66.07,43.51 65.93,43.51 65.8,43.37 65.01,43.37 64.95,43.43 v64.95,45.02 | v59.47,45.57 56.82,48.22 55.68,48.22 55.43,47.98 55.41,47.98 55.1,47.67 55.1,44.94 v54.67,44.51
/WAIT  (via drill 0.2)
  Top 0.127: v47.97,31.38 47.97,31.49 46.85,32.62 46.06,32.62 U1.42 | v48.15,30.29 50.14,30.29 51.72,28.7 51.72,25.8 50.84,24.92 50.84,22.49 55.22,18.12 55.31,18.12 v55.33,18.1 | v71.98,20.61 72.33,20.61 73.23,21.51 74.63,21.51 v74.98,21.86 | v76.66,26.61 76.45,26.61 76.1,26.96 75.33,26.96 IC4.56 | v73.86,11.6 69.88,7.61 69.88,3.84 19A.1
  Bottom 0.127: v48.15,30.29 48.15,31.27 48,31.41 v47.97,31.38 | v55.33,18.1 56.04,18.1 58.92,15.23 61.57,15.23 63.94,17.6 63.94,18.37 64.29,18.72 65.34,18.72 66.18,17.88 66.6,17.88 69.95,21.23 69.95,21.3 70.3,21.65 70.93,21.65 v71.98,20.61 | v76.66,26.61 74.98,24.94 v74.98,21.86 74.98,13.31 73.86,12.19 v73.86,11.6
/WR  (via drill 0.2)
  Top 0.127: v73.37,24.34 73.37,24.43 73.93,24.99 IC4.52 | v66.39,18.44 66.39,18.24 63.93,15.78 63.93,14.54 65.69,12.78 65.69,11.6 64.43,10.34 64.43,4.12 64.71,3.84 17A.1
  Bottom 0.127: v73.37,24.34 72.57,24.34 71.7,25.22 69.88,25.22 66.39,21.72 v66.39,18.44
/WR'  (via drill 0.2)
  Top 0.127: v53.85,32.27 55.59,30.52 59.27,30.52 IC4.13 | v49.12,35.34 49.12,35.5 45.99,38.63 44.04,38.63 U1.51 43.97,38.7 43.97,39.53 43.34,40.16 v43.34,40.51 | v45.92,56.58 47.04,57.7 47.04,59.65 45.02,61.68 43.97,61.68 U2.29 | v40.68,47.92 v41.45,48.69
  Bottom 0.127: v53.85,32.27 52.21,32.27 49.49,34.99 49.34,34.99 49.12,35.21 v49.12,35.34 | v45.92,56.58 45.71,56.58 41.45,52.32 v41.45,48.69 | v40.68,47.92 40.68,47.71 40.33,47.36 40.33,43.8 41.73,42.4 41.73,40.58 42.08,40.23 43.06,40.23 v43.34,40.51
A0  (via drill 0.2)
  Top 0.127: v56.4,24.31 57.03,24.94 59.27,24.94 IC4.24 | v43.76,12.92 43.76,11.32 v41.52,9.08
  Bottom 0.127: v56.4,24.31 56.05,24.31 52.77,21.02 52,21.02 49.21,18.23 49.21,15.51 48.58,14.88 45.71,14.88 v43.76,12.92 | v41.52,9.08 41.52,8.38 39.43,6.29 39.43,3.84 7B.1
A0'  (via drill 0.2)
  Top 0.127: v58.98,40.01 58.07,40.01 56.4,38.33 56.4,37.79 58.15,36.04 59.27,36.04 IC4.2 | 64.99,46.52 60,46.52 v59.92,46.6 | 64.99,46.52 65.76,46.52 66.55,45.73 68.87,45.73 71.16,43.45 73.09,43.45 IC8.12 | v38.03,54.48 35.1,51.55 30.91,51.55 U2.12 | 64.99,46.52 v64.99,46.94
  Bottom 0.127: v58.98,40.01 58.98,41.34 60.28,42.64 60.28,46.25 v59.92,46.6 | v38.03,54.48 38.03,55.88 43.34,61.19 47.32,61.19 48.3,62.17 57.1,62.17 60.45,58.81 65.06,58.81 65.76,58.12 65.76,55.67 64.99,54.9 v64.99,46.94
A1  (via drill 0.2)
  Top 0.127: v45.3,10.13 49.28,10.13 50.74,11.6 50.74,13.34 52.88,15.48 55.26,15.48 59.27,19.49 60.03,19.49 62.27,21.72 62.27,22.42 IC4.28
  Bottom 0.127: v45.3,10.13 44.88,10.13 41.94,7.2 41.94,3.84 8B.1
A1'  (via drill 0.2)
  Top 0.127: v67.58,40.65 67.72,40.51 67.72,38.56 IC4.87 | v69.84,43.58 70.03,43.58 72.05,41.56 74.28,41.56 74.42,41.7 74.42,43.8 73.58,44.63 73.17,44.63 IC8.13 72.87,44.4 70.63,44.4 66.88,48.16 66.88,52.18 63.18,55.88 54.31,55.88 52.56,54.13 v50.67,54.13 | v36.35,53.58 35.58,52.81 30.91,52.81 U2.11
  Bottom 0.127: v67.58,40.65 67.58,41.31 v69.84,43.58 | v36.35,53.58 40.33,53.58 40.82,53.09 41.24,53.09 44.94,56.79 44.94,57.49 45.92,58.46 46.69,58.46 48.16,57 48.16,56.65 v50.67,54.13
A2  (via drill 0.2)
  Top 0.127: v61.99,20.47 63.25,21.72 63.25,22.42 IC4.30 | v50.81,16.69 48.86,16.69 46.62,14.46 v46.62,14.32 | v44.53,12.92 44.53,11.66 43.9,11.04 v43.9,8.38
  Bottom 0.127: v61.99,20.47 56.83,20.47 56.55,20.19 54.31,20.19 v50.81,16.69 | v46.62,14.32 45.92,14.32 v44.53,12.92 | v43.9,8.38 43.9,4.33 44.39,3.84 9B.1
A2'  (via drill 0.2)
  Top 0.127: v67.79,35.9 67.79,36.48 66.81,37.46 66.81,38.49 IC4.89 | v74.67,45.31 74.16,45.31 73.58,45.89 73.17,45.89 IC8.14 | v69.53,51.76 67.72,51.76 63.32,56.16 54.17,56.16 53.19,55.18 50.95,55.18 49.56,53.78 45.99,53.78 45.22,54.55 42.99,54.55 42.5,55.04 37.82,55.04 36.91,54.13 30.91,54.13 U2.10
  Bottom 0.127: v67.79,35.9 67.79,36.25 71.07,39.53 71.07,41.71 v74.67,45.31 74.7,45.31 74.7,46.59 v69.53,51.76
A3  (via drill 0.2)
  Top 0.127: v61.92,18.65 64.78,21.51 64.78,22.42 IC4.33 | v61.92,16.34 61.92,16 58.66,12.74 56.63,12.74 v56.05,12.15
  Bottom 0.127: v61.92,16.34 v61.92,18.65 | v56.05,12.15 50.6,12.15 50.39,12.36 49.97,12.36 47.04,9.43 47.04,3.84 10B.1
A3'  (via drill 0.2)
  Top 0.127: v66.81,40.65 66.32,40.16 66.32,38.56 IC4.90 | v71.42,46.54 71.46,46.58 72.53,46.58 73.09,47.15 IC8.15 | v42.15,55.6 41.87,55.32 30.91,55.32 U2.9 | v54.38,53.99 57.17,53.99 v58.78,52.39
  Bottom 0.127: v71.42,46.54 71.37,46.54 71.36,46.53 70.7,46.53 70.37,46.2 70.37,44.84 66.81,41.28 v66.81,40.65 66.25,40.09 65.06,40.09 64.15,41 64.15,49.73 61.5,52.39 v58.78,52.39 | v42.15,55.6 42.64,55.6 45.78,58.74 47.25,58.74 48.58,57.42 49.77,57.42 53.19,53.99 v54.38,53.99
A4  (via drill 0.2)
  Top 0.127: v78.05,9.57 78.05,9.92 80.03,11.9 80.03,27.5 77.01,30.52 75.33,30.52 IC4.63
  Bottom 0.127: v78.05,9.57 78.05,4.4 77.5,3.84 22B.1
A4'  (via drill 0.2)
  Top 0.127: v66.44,37.06 66.41,37.06 65.83,37.65 65.83,38.49 IC4.91 | v71.21,45.49 70.46,46.23 70.46,47.16 71.77,48.48 71.83,48.48 IC8.16 | v32.65,57.28 32.02,56.65 30.91,56.65 U2.8 | v17.42,22.28 16.87,22.28 v16.31,22.85 | v24.27,10.69 38.24,10.69 40.27,12.71 40.27,13.97 41.66,15.37 v42.57,15.37 | v64.86,35.14 65.05,34.95 65.05,31.77 64.74,31.47 62.68,31.47 v62.65,31.5
  Bottom 0.127: v71.21,45.49 71.13,45.41 71.13,44.03 68.14,41.03 68.14,40.44 66.44,38.75 v66.44,37.06 65.81,37.06 64.86,36.12 v64.86,35.14 | v32.65,57.28 32.65,59.51 28.94,63.23 28.9,63.23 28.88,63.24 28.45,63.24 26.5,61.29 11.31,61.29 4.15,54.14 4.15,45.05 13.65,35.55 13.65,30.66 14.14,30.18 14.42,30.18 15.75,28.85 15.75,23.41 v16.31,22.85 | v17.42,22.28 17.42,21.58 20.08,18.93 20.08,14.39 23.78,10.69 v24.27,10.69 | v42.57,15.37 45.3,18.09 47.25,18.09 49.77,20.61 50.39,20.61 54.38,24.59 54.58,24.59 55.35,25.36 55.35,25.64 59.62,29.91 61.16,29.91 62.49,31.24 62.49,31.5 v62.65,31.5
A5  (via drill 0.2)
  Top 0.127: v76.66,28.57 76.24,28.99 75.33,28.99 IC4.60
  Bottom 0.127: v76.66,28.57 76.83,28.4 76.83,27.25 77.2,26.87 78.23,26.87 79.51,25.59 79.51,14.45 74.98,9.92 74.98,3.84 21B.1
A5'  (via drill 0.2)
  Top 0.127: v65.95,36.47 65.34,37.07 65.34,38.49 IC4.92 | IC8.17 73.09,49.73 72.25,49.73 v71.04,48.52 69.77,48.52 67.79,50.5 v67.44,50.5 | v38.8,55.88 36.84,57.84 30.91,57.84 U2.7 | v40.47,54.2 42.08,54.2 42.78,53.51 52.35,53.51 54.44,55.6 62.69,55.6 v66.32,51.97
  Bottom 0.127: v65.95,36.47 66.74,36.47 68.42,38.14 68.42,40.9 72.05,44.54 72.05,47.52 v71.04,48.52 | v40.47,54.2 v38.8,55.88 | v66.32,51.97 66.32,51.62 v67.44,50.5
A6  (via drill 0.2)
  Top 0.127: v65.9,23.89 65.34,23.33 65.34,22.49 IC4.34 | v68.62,25.97 68.78,25.97 v70.09,24.66 | v70.16,12.5 70.16,11.39 v69.67,10.9 | v52.42,9.92 52.42,9.57 49.56,6.71 49.56,3.84 11A.1
  Bottom 0.127: v65.9,23.89 66.25,23.89 68.33,25.97 v68.62,25.97 | v70.09,24.66 70.65,24.66 72.61,22.7 72.61,14.95 v70.16,12.5 | 69.15,10.37 69.11,10.34 69.11,9.92 72.33,6.71 72.33,3.84 20B.1 | 69.15,10.37 v69.67,10.9 | v52.42,9.92 60.38,9.92 61.01,10.55 64.64,10.55 64.78,10.69 68.83,10.69 69.15,10.37
A6'  (via drill 0.2)
  Top 0.127: v66.04,40.65 64.85,39.47 64.85,38.56 IC4.93 | v70.37,49.38 70.65,49.38 72.26,50.99 73.09,50.99 IC8.18 73.17,50.99 v74.98,50.99 | v39.08,59.16 30.91,59.16 U2.6 | v77.92,53.3 77.92,50.57 v77.36,50.01
  Bottom 0.127: v66.04,40.65 66.04,40.93 70.09,44.98 70.09,49.1 v70.37,49.38 | v39.08,59.16 42.64,62.73 68.14,62.73 77.56,53.3 v77.92,53.3 | v77.36,50.01 75.96,50.01 v74.98,50.99
A7  (via drill 0.2)
  Top 0.127: v78.5,25.63 78.5,27.08 77.56,28.01 75.33,28.01 IC4.58 | v69.88,8.38 v71.84,10.34
  Bottom 0.127: v78.5,25.63 78.36,25.49 78.36,16.27 74.42,12.33 74.42,11.39 73.37,10.34 v71.84,10.34 | v69.88,8.38 69.88,3.84 19B.1
A7'  (via drill 0.2)
  Top 0.127: v65.27,40.65 64.29,39.67 64.29,38.56 IC4.94 | v70.37,50.15 70.58,50.15 72.68,52.25 73.09,52.25 IC8.19 | v42.15,61.47 33.21,61.47 32.16,60.42 30.91,60.42 U2.5
  Bottom 0.127: v70.37,50.15 69.81,49.59 69.81,47.18 68.11,45.48 68.11,44.44 66.71,43.03 66.67,42.99 66.67,42.77 66.36,42.47 65.93,42.47 65.91,42.5 65.31,42.5 | v42.15,61.47 47.18,61.47 48.16,62.45 62.9,62.45 64.78,60.56 64.78,60 65.97,58.81 67.86,58.81 68.9,57.77 68.9,56.51 70.51,54.9 70.51,53.51 68,50.99 68,49.17 64.43,45.61 64.43,43.38 65.31,42.5 | 65.22,42.6 65.27,42.54 v65.27,40.65 | 65.22,42.6 | 65.22,42.6 65.31,42.5
A8  (via drill 0.2)
  Top 0.127: v78.09,15.25 78.09,24.25 77.11,25.23 77.11,25.4 76.03,26.47 75.33,26.47 IC4.55 | v67.93,8.38 v69.67,10.13
  Bottom 0.127: v78.09,15.25 78.09,14.22 73.09,9.22 70.23,9.22 69.67,9.78 v69.67,10.13 | v67.93,8.38 67.93,4.4 67.37,3.84 18B.1
A8'  (via drill 0.2)
  Top 0.127: v63.73,40.16 63.73,38.56 IC4.95 | v44.81,38.07 44.67,38.07 44.32,37.72 43.27,37.72 43.06,37.93 43.06,38.63 U1.53 | v46.2,59.3 46.06,59.16 43.97,59.16 U2.27 | v48.79,57.98 48.79,57.63 v49.56,56.86 | v53.26,53.16 55.91,53.16 v57.17,51.9
  Bottom 0.127: v63.73,40.16 63.73,49.73 61.36,52.11 59.4,52.11 58.18,50.89 58.06,51.01 58,51.07 | 58,51.07 54.55,47.63 54.55,45.58 51.58,42.61 48.79,42.61 44.81,38.63 v44.81,38.07 | v46.2,59.3 47.46,59.3 v48.79,57.98 | v53.26,53.16 v49.56,56.86 | 58,51.07 v57.17,51.9
A9  (via drill 0.2)
  Top 0.127: IC4.53 76.01,25.49 77.34,24.17 77.34,14.83 v77.56,14.6 | v70.44,9.78 70.09,9.78 v69.25,8.94
  Bottom 0.127: v77.56,14.6 77.56,14.11 73.23,9.78 v70.44,9.78 | v69.25,8.94 67.44,8.94 64.78,6.29 64.78,3.84 17B.1
A9'  (via drill 0.2)
  Top 0.127: v39.15,40.37 39.43,40.65 41.31,40.65 42.5,39.47 42.5,38.7 U1.54 | v38.52,46.87 38.52,49.73 v40.13,51.34 | v45.5,57.28 44.53,57.28 43.97,57.84 U2.26 | v55.63,47.46 55.25,47.46 52.42,50.29 49.91,50.29 v49.69,50.08 | IC4.96 63.25,38.56 63.25,39.26 62.1,40.4 61.08,40.4 60.04,39.37 v59.45,39.37
  Bottom 0.127: v39.15,40.37 39.15,43.03 38.52,43.66 38.52,44.77 38.8,45.05 38.8,46.59 v38.52,46.87 | v40.13,51.34 40.13,51.55 45.5,56.93 45.5,57.14 | v59.45,39.37 59.44,39.35 58.67,39.35 56.19,41.82 56.19,46.89 v55.63,47.46 | v49.69,50.08 49.69,50.43 48.65,51.48 48.65,53.99 47.32,55.32 47.32,55.95 46.13,57.14 45.5,57.14 | 45.5,57.14 v45.5,57.28
A10  (via drill 0.2)
  Top 0.127: v72.07,18.97 72.15,18.88 72.77,18.88 75.54,21.65 75.54,22.07 75.19,22.42 73.3,22.42 IC4.50 | v64.99,8.38 v69.11,12.5
  Bottom 0.127: v72.07,18.97 72.07,15.49 72.19,15.37 72.19,14.95 70.3,13.06 69.67,13.06 v69.11,12.5 | v64.99,8.38 64.36,8.38 62.27,6.29 62.27,3.84 16B.1
A10'  (via drill 0.2)
  Top 0.127: v58.43,37.3 58.5,37.23 59.82,37.23 60.31,36.74 60.31,35.76 60.1,35.55 59.33,35.55 IC4.3 | v44.41,34.59 44.41,35.74 43.44,36.71 43.43,36.72 | 43.43,36.72 43.49,36.79 42.56,37.72 42.29,37.72 42.08,37.93 42.08,38.63 U1.55 | v37.61,50.78 37.61,52.11 40.27,54.76 41.94,54.76 42.57,54.13 43.9,54.13 U2.23 | 43.43,36.72 v43.26,36.54
  Bottom 0.127: v58.43,37.3 57.45,37.3 56.47,36.32 55.28,36.32 54.72,36.88 54.72,37.09 54.38,37.44 48.52,37.44 45.66,34.59 v44.41,34.59 | v37.61,50.78 37.61,48.55 39.08,47.08 39.08,44.77 38.8,44.49 38.8,43.8 39.71,42.89 39.71,37.87 41.42,36.15 42.87,36.15 v43.26,36.54
A11  (via drill 0.2)
  Top 0.127: v73.26,27.54 72.46,27.54 72.15,27.23 72.15,24.55 71.35,23.75 71.35,22.49 IC4.46 | v66.32,8.94 v68.62,11.25
  Bottom 0.127: v73.26,27.54 73.92,27.54 74.42,27.03 74.42,13.16 72.72,11.46 68.83,11.46 v68.62,11.25 | v66.32,8.94 63.11,8.94 62.13,7.96 61.36,7.96 59.75,6.36 59.75,3.84 15B.1
A11'  (via drill 0.2)
  Top 0.127: v54.72,39.12 54.72,38.77 58.5,34.99 59.27,34.99 IC4.4 | v41.66,36.69 41.66,38.56 41.59,38.63 U1.56 | v46.76,55.74 45.99,55.74 45.16,56.58 43.97,56.58 U2.25
  Bottom 0.127: v54.72,39.12 54.45,38.84 52.71,38.84 51.11,40.44 48.19,40.44 45.3,37.55 44.56,37.55 44.49,37.62 | v41.66,36.69 41.85,36.5 42.48,36.5 43.59,37.62 44.49,37.62 | v46.76,55.74 46.76,55.46 48.37,53.85 48.37,42.61 44.25,38.49 44.25,37.86 44.49,37.62
A12  (via drill 0.2)
  Top 0.127: v64.99,10.13 69.04,14.18 69.04,20.4 69.25,20.61 69.25,22.42 IC4.42
  Bottom 0.127: v64.99,10.13 61.01,10.13 57.17,6.29 57.17,3.84 14B.1
A12'  (via drill 0.2)
  Top 0.127: v56.96,38 58.43,36.53 59.27,36.53 IC4.1 | v47.74,38.28 47.74,38.49 45.85,40.37 v44.94,40.37 | v41.1,37.3 41.1,38.56 41.03,38.63 U1.57 | v29.23,61.05 29.86,61.68 30.84,61.68 U2.4
  Bottom 0.127: v56.96,38 55.21,38 54.93,38.28 v47.74,38.28 | v44.94,40.37 44.39,40.37 42.19,38.17 | 42.19,38.17 41.31,37.3 v41.1,37.3 | v29.23,61.05 29.23,59.93 39.36,49.8 39.36,44.63 39.08,44.35 39.08,43.94 39.99,43.03 39.99,40.37 42.19,38.17
A13  (via drill 0.2)
  Top 0.127: v67.38,15.9 67.28,16.01 67.28,16.88 68.28,17.88 68.28,22.42 IC4.40 | v64.36,12.78 64.36,12.5 60.24,8.38 v56.75,8.38
  Bottom 0.127: v67.38,15.9 64.36,12.89 v64.36,12.78 | v56.75,8.38 54.65,6.29 54.65,3.84 13B.1
A13'  (via drill 0.2)
  Top 0.127: v41.1,40.09 40.55,39.53 40.55,38.7 U1.58 | v45.64,55.32 44.88,56.09 42.71,56.09 42.57,56.23 42.57,59.51 43.41,60.35 43.9,60.35 U2.28 | v57.94,38.56 58.98,37.51 61.57,37.51 61.78,37.72 IC4.99 | v48.86,39.12 48.86,41.07 v47.25,42.68
  Bottom 0.127: v41.1,40.09 41.8,40.09 41.94,39.95 43.55,39.95 45.85,42.26 45.85,42.68 | 45.85,42.68 45.85,51.27 45.57,51.55 45.57,55.25 v45.64,55.32 | v57.94,38.56 49.42,38.56 v48.86,39.12 | 45.85,42.68 v47.25,42.68
A14  (via drill 0.2)
  Top 0.127: v64.5,18.16 64.5,18.51 66.74,20.75 66.74,22.42 IC4.37 | v54.49,13.82 52.98,12.31 v52.98,8.38
  Bottom 0.127: v64.5,18.16 64.5,17.74 60.83,14.07 54.75,14.07 v54.49,13.82 | v52.98,8.38 52.98,4.75 52.07,3.84 12B.1
A14'  (via drill 0.2)
  Top 0.127: IC4.11 59.26,31.47 56.47,31.47 v56.4,31.47 | v40.07,32.27 39.39,32.94 39.39,33.67 39.91,34.18 v39.91,34.29 39.91,38.52 U1.59 | v28.11,61.4 29.65,62.94 30.84,62.94 U2.3 | v34.87,41.93 34.87,40.43 35.23,40.07 v36.53,40.07
  Bottom 0.127: v56.4,31.47 56.4,30.94 53.91,28.45 53.87,28.45 53.75,28.33 53.32,28.33 53.02,28.63 53.02,28.69 52.57,29.14 44.91,29.14 44.26,29.79 42.63,29.79 40.14,32.27 v40.07,32.27 | v28.11,61.4 28.11,59.86 34.96,53.01 34.96,42.02 v34.87,41.93 | v36.53,40.07 34.73,38.28 34.73,37.21 34.75,37.19 34.75,36.95 35.24,36.46 36.67,36.46 37.35,35.78 38.38,35.78 39.87,34.29 v39.91,34.29
A15  (via drill 0.2)
  Top 0.127: v49.69,8.38 51.02,9.71 51.02,11.53 54.16,14.66 55.26,14.66 57.91,17.31 61.35,17.31 65.76,21.72 65.76,22.42 IC4.35
  Bottom 0.127: v49.69,8.38 49.69,3.98 49.56,3.84 11B.1
A15'  (via drill 0.2)
  Top 0.127: v56.78,35.9 56.78,35.73 58.5,34.02 59.27,34.02 IC4.6 | v43.83,35.55 42.62,34.34 42.62,32.29 42.02,31.69 39.39,31.69 39.05,32.03 39.05,37.07 39.53,37.91 U1.60 | v48.72,56.86 48.23,57.35 48.23,60.35 44.39,64.19 43.97,64.19 U2.31 | v54.1,49.87 56.19,47.78 56.19,47.24 v55.62,46.67
  Bottom 0.127: v56.78,35.9 v56.78,35.91 57.78,35.91 58.98,37.12 58.98,37.51 58.64,37.86 58.5,37.86 | 58.5,37.86 57.59,37.86 57.17,37.44 55.35,37.44 54.79,38 48.23,38 47.11,36.88 45.16,36.88 v43.83,35.55 | v48.72,56.86 51.86,53.72 51.86,50.99 52.98,49.87 v54.1,49.87 | v55.62,46.67 55.62,41.64 58.5,38.77 58.5,37.86
A16'  (via drill 0.2)
  Top 0.127: v36.63,27.73 35.66,26.75 35.66,26.05 37.47,24.24 37.47,22.7 U1.12 | v55.49,36.88 55.49,36.25 58.22,33.53 59.27,33.53 IC4.7 | v28.67,62.73 30.14,64.19 30.84,64.19 U2.2 | v36.6,41.07 36.6,42.81 v36.27,43.14 | v33.66,34.3 33.24,34.71 v33.24,36.16
  Bottom 0.127: v36.63,27.73 36.63,28.57 36.84,28.78 36.84,31.07 37.88,32.1 37.88,33.19 37.58,33.5 36.95,33.5 35.67,34.77 34.59,34.77 34.11,34.3 v33.66,34.3 | 36.6,40.65 36.77,40.65 37.65,39.78 37.65,37.83 37.28,37.47 37.28,37.04 37.7,36.62 39.4,36.62 39.64,36.39 39.64,36.07 40.11,35.59 42.16,35.59 42.72,35.03 44.08,35.03 45.64,36.6 47.24,36.6 48.36,37.72 54.65,37.72 v55.49,36.88 | 36.6,40.65 36.35,40.65 36.07,40.37 36.06,40.37 35.79,40.1 35.55,40.1 33.24,37.79 v33.24,36.16 | v28.67,62.73 28.67,59.72 36.33,52.06 36.33,43.2 v36.27,43.14 | 36.6,40.65 v36.6,41.07
A17'  (via drill 0.2)
  Top 0.127: v57.17,33.11 57.24,33.04 59.27,33.04 IC4.8 | v54.44,57 53.96,57 53.26,56.3 48.51,56.3 47.95,56.86 47.95,59.72 44.74,62.94 43.97,62.94 U2.30 | v53.68,45.45 53.68,44.77 54.31,44.15 54.31,43.73 v53.61,43.03 | v53.01,39.39 53.01,34.92 55.56,32.38 v55.56,32.01 | U1.48 45.9,35.55 45.19,35.55 45.06,35.43 45.06,34.5 43.75,33.19 43.75,32.68 v43,31.93
  Bottom 0.127: v57.17,33.11 57.03,32.97 55.72,32.97 55.03,32.28 | 55.03,32.28 54.47,31.71 48.9,31.71 48.41,32.2 43.27,32.2 v43,31.93 | v54.44,57 54.44,55.81 55.28,54.97 55.28,52.81 55.21,52.74 55.21,48.73 54.26,47.78 54.26,46.03 v53.68,45.45 | v53.61,43.03 53.01,42.43 v53.01,39.39 | v55.56,32.01 55.49,31.94 55.37,31.94 55.03,32.28
A18'  (via drill 0.2)
  Top 0.127: v55.91,33.6 56.96,32.55 59.27,32.55 IC4.9 | v33.63,64.61 32.79,65.45 30.91,65.45 U2.1 | v35.58,62.66 42.5,62.66 42.99,62.17 45.08,62.17 47.32,59.93 47.32,56.51 v49.21,54.62 | v49.21,43.17 49.21,42.33 49.14,42.26 49.14,39.6 50.81,37.93 v50.81,34.58 50.56,34.33 47.6,34.33 46.88,35.05 46.17,35.05 U1.47
  Bottom 0.127: v55.91,33.6 55.56,33.25 v52,33.25 50.81,34.44 v50.81,34.58 | v35.58,62.66 v33.63,64.61 | v49.21,54.62 49.21,51.76 50.53,50.43 50.53,46.8 49.21,45.47 v49.21,43.17
ALE  (via drill 0.2)
  Top 0.127: v33.56,42.14 34.54,41.16 U1.70 | v33.26,43.27 v33.25,43.27 32.76,43.27 v31.05,44.98 | v29.16,50.78 35.52,50.78 v37.33,52.6 | v43.83,45.54 44.6,45.54 45.02,45.96 47.81,45.96 49.56,47.71 53.05,47.71 53.32,47.43 54.1,47.43 55.49,46.05 56,46.05 56.4,46.45 58.64,46.45 58.74,46.34 58.74,45.46 61.14,43.07 61.74,43.07 62.01,42.8 64.16,42.8 64.16,42.83 64.31,42.98 64.31,43.64 66.12,45.45 68.72,45.45 71.98,42.19 73.09,42.19 IC8.11
  Bottom 0.127: v33.56,42.14 33.56,42.97 v33.26,43.27 | v31.05,44.98 31.05,48.9 v29.16,50.78 | v37.33,52.6 37.33,52.25 40.89,48.69 40.89,48.48 v43.83,45.54
AREF
  Top 0.127: C6.1 18.05,21.09 18.4,21.09 19.13,20.36 20.7,20.36 21.06,20.73 21.06,23 22.48,24.42 25.88,24.42 27.15,25.69 U1.98
B0  (via drill 0.2)
  Top 0.127: v31.39,27.17 31.39,26.82 30.77,26.19 30.07,26.19 U1.97 | IC9.12 13.16,47.22 13.65,46.73 17.92,46.73 18.63,46.02 v18.63,45.6
  Bottom 0.127: v31.39,27.17 31.39,28.66 25.42,34.64 25.42,36.83 21.02,41.23 21.02,41.94 20.22,42.74 20.22,44.12 18.73,45.6 v18.63,45.6
B1  (via drill 0.2)
  Top 0.127: v19.8,32.69 20.92,31.57 23.01,31.57 23.29,31.29 23.29,30.45 23.15,30.32 21.06,30.32 20.78,30.04 20.78,29.2 20.99,28.99 23.08,28.99 25.32,26.75 30,26.75 U1.96 | v12.17,44.2 12.17,44.24 10.79,45.62 10.79,46.59 12.67,48.48 13.09,48.48 IC9.13
  Bottom 0.127: v19.8,32.69 19.8,39.26 17.49,41.56 14.79,41.56 14.51,41.84 14.47,41.84 12.68,43.62 12.68,43.7 v12.17,44.2
B2  (via drill 0.2)
  Top 0.127: v26.65,28.99 28.39,27.24 30,27.24 U1.95 | v15.26,48.69 15.05,48.69 14,49.73 13.16,49.73 IC9.14
  Bottom 0.127: v26.65,28.99 26.65,30.59 24.84,32.39 24.84,36.57 19.78,41.64 19.78,43.6 15.26,48.12 v15.26,48.69
B3  (via drill 0.2)
  Top 0.127: v32.44,28.29 31.88,27.73 30.07,27.73 U1.94 | IC9.15 13.16,51.09 14.39,51.09 v14.77,50.71
  Bottom 0.127: v32.44,28.29 32.44,29.69 26.62,35.51 26.62,35.62 26.34,35.9 26.34,36.71 22.11,40.94 22.11,41.86 21.81,42.17 21.22,42.17 20.5,42.89 20.5,44.24 19.17,45.57 19.17,45.91 15.48,49.6 15.48,50.01 v14.77,50.71
B4  (via drill 0.2)
  Top 0.127: v28.25,28.15 30,28.15 U1.93 | v23.99,27.33 23.13,26.47 v19.17,26.47 | v17.91,25.98 16.45,25.98 v16.31,26.12 | v14.77,39.82 14.77,41 v16.17,42.4 | v14.73,47.96 14.35,48.34 14.35,48.97 14.14,49.17 12.05,49.17 11.84,49.38 11.84,51.48 12.6,52.25 13.09,52.25 IC9.16
  Bottom 0.127: v28.25,28.15 24.81,28.15 v23.99,27.33 | v19.17,26.47 18.4,26.47 v17.91,25.98 | v16.31,26.12 16.31,29.83 15.4,30.73 15.4,39.19 v14.77,39.82 | v16.17,42.4 16.17,46.52 v14.73,47.96
B5  (via drill 0.2)
  Top 0.127: v26.65,31.36 29.3,28.71 30,28.71 U1.92 | v20.35,41.84 19.8,41.84 18.38,43.26 18.36,43.24 14.66,43.24 14.35,42.92 12.7,42.92 10.51,45.11 10.51,48.12 11.52,49.12 11.52,49.55 11.24,49.83 11.24,52.26 12.55,53.58 13.09,53.58 IC9.17
  Bottom 0.127: v26.65,31.36 26.65,32.92 25.14,34.43 25.14,36.7 20.35,41.49 v20.35,41.84
B6  (via drill 0.2)
  Top 0.127: U1.91 29.33,29.19 28.51,30.01 28.51,30.27 26.65,32.13 26.65,38.03 26.62,38.05 26.62,38.51 26.65,38.53 26.65,40.4 22.24,44.81 16.33,44.81 15.62,44.09 v14.88,44.09 | v10.74,54.72 12.98,54.72 IC9.18
  Bottom 0.127: v14.88,44.09 14.63,44.35 14.63,45.03 10.88,48.78 10.72,48.78 10.35,49.15 10.35,54.33 v10.74,54.72
B7  (via drill 0.2)
  Top 0.127: 29.19,29.82 29.33,29.69 U1.90 29.9,29.82 29.19,29.82 | 29.19,29.82 28.79,30.23 28.79,30.39 26.92,32.25 26.92,40.52 22.36,45.09 15.88,45.09 v15.52,44.73 | v14.95,46.02 14.9,46.02 13.48,44.59 v13.26,44.59 | v9.66,55.15 9.9,55.15 10.87,56.12 IC9.19
  Bottom 0.127: v15.52,44.73 14.95,45.31 v14.95,46.02 | v13.26,44.59 13.26,45.42 9.66,49.01 v9.66,55.15
CFG_CLK  (via drill 0.2)
  Top 0.127: IC4.54 74.06,25.99 73.53,25.46 73.1,25.46 72.8,25.77 72.8,26.2 73.1,26.5 73.15,26.5 73.79,27.14 73.79,27.9 73.53,28.16 71.69,28.16 71.69,28.15 70.91,28.15 v70.38,27.62 | v69.58,28.8 69.58,29.44 v68.3,30.72 | v63.93,32 63.19,32 62.8,32.39 62.8,32.49 61.36,33.92 v61.34,33.92 | U1.79 31.31,35.19 32.8,36.68 33.46,36.68 33.76,36.37 33.76,36.18 v34.09,35.85
  Bottom 0.127: v70.38,27.62 69.58,28.42 v69.58,28.8 | v68.3,30.72 67.2,31.82 64.87,31.82 64.7,32 v63.93,32 | v61.34,33.92 60.74,34.52 57.12,34.52 52.47,34.52 51.13,35.87 48.89,35.87 48.59,35.56 48.59,34.88 46.85,33.15 42.32,33.15 42.14,33.32 41.01,33.32 40.7,33.63 39.51,33.63 39.3,33.84 39.3,34.47 38.41,35.35 37.33,35.35 36.97,35.7 34.24,35.7 v34.09,35.85
CFG_DATA  (via drill 0.2)
  Top 0.127: IC4.74 75.17,35.88 74.44,35.88 73.65,35.09 73.65,34.38 v73.41,34.14 | v71.24,30.36 68.41,33.2 v68.1,33.2 | v64.1,35.17 63.86,35.41 63.75,35.41 62.78,36.39 61.43,36.39 v61.39,36.35 | v36.04,37.26 36.04,37.28 35.55,37.78 35.55,38.67 U1.68
  Bottom 0.127: v73.41,34.14 73.41,31.05 72.44,30.07 72.41,30.07 72.37,30.04 71.56,30.04 v71.24,30.36 | v68.1,33.2 65.95,33.2 64.1,35.05 v64.1,35.17 | v61.39,36.35 60.55,35.51 60.55,35.42 60.49,35.36 52.82,35.36 51.37,36.81 48.5,36.81 47.73,36.04 47.73,35.21 46.53,34.01 43.16,34.01 42.67,34.5 41.79,34.5 40.98,35.31 40,35.31 39.36,35.95 39.36,36.27 39.29,36.34 37.58,36.34 36.67,37.26 v36.04,37.26
CFG_RESET  (via drill 0.2)
  Top 0.127: IC4.59 71.79,28.49 71.79,28.5 71.74,28.5 71.57,28.67 v71.47,28.67 | v70.19,29.26 70.19,29.6 v68.31,31.48 | v64.11,33.35 62.66,34.8 v61.37,34.8 | U1.69 35.02,38.67 35.02,37.7 35.26,37.45 v35.26,37.17
  Bottom 0.127: v71.47,28.67 71.43,28.71 71.41,28.71 70.86,29.26 v70.19,29.26 | v68.31,31.48 67.69,32.1 65.92,32.1 64.67,33.35 v64.11,33.35 | v61.37,34.8 52.59,34.8 51.14,36.25 48.73,36.25 48.31,35.83 48.31,35 46.73,33.42 42.95,33.42 42.43,33.94 40.88,33.94 40.58,34.25 40.58,34.68 40.63,34.74 40.33,35.03 39.88,35.03 38.86,36.06 37.47,36.06 36.79,36.74 35.83,36.74 35.4,37.17 v35.26,37.17
CS_LLS
  Top 0.127: MICRO_SD1.2 12.81,32.83 13.51,32.83 14.91,31.43 17.77,31.43 19.52,29.69 19.52,29.13 21.55,27.1 21.97,27.1 IC6.8
CTRL_CLK  (via drill 0.2)
  Top 0.127: v42.92,44.56 42.15,44.56 40.89,43.31 39.5,43.31 37.54,41.35 U1.64 | v45.3,42.96 45.3,43.24 46.48,44.42 48.72,44.42 50.11,43.03 50.11,42.89 50.32,42.68 52.42,42.68 53.4,41.7 53.82,41.7 55.42,43.31 57.45,43.31 IC3.9
  Bottom 0.127: v42.92,44.56 43.69,44.56 v45.3,42.96
D0  (via drill 0.2)
  Top 0.127: v31.39,36.04 31.05,35.69 30.07,35.69 U1.78 | IC5.12 26.59,47.74 v24.86,47.74 24.47,48.13 24.47,48.95 25.95,50.43 28.11,50.43 28.32,50.22 30.84,50.22 U2.13 | 5.83,47.29 8.93,47.29 10.98,49.34 v11,49.34 | 5.83,47.29 3.1,47.29 IC9.9 | v14.87,49.81 15.32,49.81 16.03,49.1 18.92,49.1 v20.56,47.47 | v61.64,29.62 60.03,28.01 59.33,28.01 IC4.18 | v61.24,45.66 61.22,45.65 61.16,45.65 60.7,45.19 60.7,44.1 61.36,43.45 63.04,43.45 IC8.9 | v41.66,14.18 40.89,14.18 40.55,13.83 40.55,12.57 37.54,9.57 34.05,9.57 31.81,7.33 31.81,3.84 4A.1 31.81,7.4 v28.32,7.4 | v51.36,23.68 52.56,23.68 v53.4,22.84 | v5.83,42.61 5.83,47.29 | v17.84,15.3 19.94,15.3 v20.64,14.6
  Bottom 0.127: v31.39,36.04 31.39,36.2 30.68,36.92 30.62,36.92 30.32,37.23 30.32,37.66 30.48,37.82 30.48,38.17 26.16,42.49 26.16,46.83 25.24,47.74 v24.86,47.74 24.29,48.31 24.29,48.99 23.59,49.7 21.3,49.7 20.56,48.96 v20.56,47.47 | v11,49.34 14.87,49.34 v14.87,49.81 | v61.24,45.66 61.34,45.66 62.83,44.18 62.83,39.88 63.46,39.26 63.46,33.11 63.22,32.87 63.22,31.19 v61.64,29.62 59.75,29.62 55.63,25.5 55.63,25.22 53.4,22.98 v53.4,22.84 | v41.66,14.18 41.66,13.41 41.31,13.06 40.89,13.06 40.55,13.41 40.55,14.81 49.42,23.68 v51.36,23.68 | v5.83,42.61 5.83,40.58 10.79,35.62 10.79,31.29 12.88,29.2 13.09,29.2 15.47,26.82 15.47,22.7 17.84,20.33 v17.84,15.3 | v20.64,14.6 21.13,14.6 v28.32,7.4
D1  (via drill 0.2)
  Top 0.127: IC8.8 62.99,44.58 v61.53,44.58 | v25.17,48.49 25.27,48.59 27,48.59 IC5.13 27.06,48.62 27.41,48.97 30.84,48.97 U2.14 | v6.18,50.43 4.29,48.55 3.1,48.55 IC9.8 | v34.26,9.01 34.26,3.84 5A.1 | v35.35,15.86 34.61,16.59 34.61,19.14 33.28,20.47 v33.14,20.47 | v53.33,30.73 53.33,30.66 56.47,27.52 59.27,27.52 IC4.19 59.33,27.52 60.31,27.52 62.05,29.26 62.05,29.29 62.16,29.4 62.16,29.83 61.53,30.46 v61.53,31.06 | v43.79,31.63 43.73,31.63 43.51,31.41 38.16,31.41 36.28,33.28 36.28,34.39 35.54,35.13 | 35.54,35.13 33.54,37.14 31.31,37.14 31.02,37.44 v30.84,37.44 31,37.28 31,36.45 30.74,36.19 U1.77 | v37.42,30.45 37.44,30.46 37.44,30.86 34.17,34.12 34.17,34.81 34.5,35.13 35.54,35.13 | 35.54,35.13
  Bottom 0.127: v61.53,31.06 61.66,31.19 61.66,31.43 62.74,32.52 62.74,36.94 62.55,37.14 62.55,43.56 v61.53,44.58 | v30.84,37.44 30.84,38.21 26.44,42.61 26.44,47.23 v25.17,48.49 24.57,49.09 24.57,49.11 23.7,49.98 21.81,49.98 19.98,51.81 19.98,52.89 23.99,56.91 23.99,57.91 21.81,60.08 12.85,60.08 5.97,53.21 5.97,52.88 6.18,52.67 v6.18,50.43 | v35.35,15.86 34.11,14.62 34.11,9.16 v34.26,9.01 | v33.14,20.47 33.77,21.1 33.77,22.91 37.42,26.56 v37.42,30.45 | v53.33,30.73 49.49,30.73 48.29,31.93 44.09,31.93 v43.79,31.63
D2  (via drill 0.2)
  Top 0.127: v21.2,52.85 19.84,54.2 9.18,54.2 4.78,49.8 3.1,49.8 IC9.7 | IC5.14 27.06,49.8 27.2,49.66 v28.67,49.66 31.88,49.66 32.23,49.31 32.23,48.69 31.33,47.78 30.91,47.78 U2.15 | v55.6,27.55 55.64,27.55 56.16,27.03 59.27,27.03 IC4.20 59.33,27.03 60.24,27.03 61.15,27.94 v61.5,27.94 | v36.96,34.24 36.9,34.18 33.64,37.44 31.6,37.44 31.05,38 30.63,38 30.59,37.96 | 30.59,37.96 30.07,37.44 30.07,36.74 U1.76 | v65.55,45.99 65.46,45.89 63.11,45.89 IC8.7 | v69.58,40.39 69.58,40.8 66.25,44.13 65.73,44.13 v65.66,44.05 | v65.57,34.47 65.58,34.45 65.58,30.49 v63.04,27.94 | v38.87,9.43 36.84,7.4 36.84,3.84 6A.1 | v39.99,10.55 39.99,10.69 v43.76,14.46 | v54.17,17.76 54.14,17.8 48.66,17.8 v48.65,17.81 | v55.23,18.86 55.23,21.93 v52.06,25.11 | v29.67,40.2 29.67,38.88 30.59,37.96
  Bottom 0.127: v21.2,52.85 21.83,53.48 24.85,53.48 v28.67,49.66 28.67,45.82 29.67,44.82 v29.67,40.2 | v55.6,27.55 55.6,27.45 54.4,27.45 v52.06,25.11 52.06,27.83 51.33,28.56 43.45,28.56 41.67,30.34 41.24,30.34 41.21,30.31 39.06,30.31 38.18,31.2 38.18,33.34 37.74,33.78 37.38,33.78 36.96,34.21 v36.96,34.24 | v65.66,44.05 65.53,43.93 65.53,45.97 v65.55,45.99 | v61.5,27.94 v63.04,27.94 | v39.99,10.55 v38.87,9.43 | v43.76,14.46 44.53,15.23 45.22,15.23 47.81,17.81 v48.65,17.81 | v54.17,17.76 54.14,17.79 55.21,18.86 v55.23,18.86 | v69.58,40.39 68.69,39.5 68.69,37.98 65.99,35.27 65.57,34.86 v65.57,34.47
D3  (via drill 0.2)
  Top 0.127: v62.55,23.89 62.76,23.68 62.76,22.49 IC4.29 | v45.3,12.92 45.3,11.32 44.63,10.65 | 44.63,10.65 44.46,10.48 44.46,3.84 9A.1 | v4.71,51.76 4.01,51.06 3.1,51.06 IC9.6 3.03,51.06 2.62,51.06 1.78,51.9 1.78,57.84 2.06,58.12 v2.06,58.4 | v29.23,53.44 29.23,52.25 28.11,51.13 27.06,51.13 IC5.15 26.99,51.06 26.16,51.06 24.12,49.03 24.12,47.22 25.95,45.4 29.93,45.4 30.07,45.54 31.67,45.54 31.71,45.51 | 34.08,43.27 34.47,43.66 40.83,43.66 43.55,46.38 43.9,46.38 U2.17 | U1.75 32.09,38.7 32.09,41.41 33.34,42.66 33.4,42.66 34.01,43.27 34.08,43.27 | v59.12,48.87 60.77,47.22 63.04,47.22 IC8.6 | v59.19,50.85 58.84,50.85 58.36,51.34 56.68,51.34 56.05,51.97 52.42,51.97 51.65,51.2 46.55,51.2 45.08,49.73 42.5,49.73 40.33,51.9 39.92,51.9 33.77,45.75 31.95,45.75 31.71,45.51 | 31.71,45.51 31.6,45.4 31.6,44.98 32.79,43.8 33.45,43.8 33.49,43.76 33.6,43.76 34.08,43.27 | v44.46,10.83 44.63,10.65 | v24.83,10.13 v35.03,10.13
  Bottom 0.127: v62.55,23.89 58.95,23.89 55.98,20.92 54,20.92 53.83,20.75 52.14,20.75 49.49,18.09 49.49,15.37 47.88,13.76 46.13,13.76 v45.3,12.92 | v4.71,51.76 4.71,54.29 11.34,60.92 25.73,60.92 29.23,57.42 v29.23,53.44 | v59.19,50.85 59.12,50.78 v59.12,48.87 | v44.46,10.83 40.47,10.83 40.19,11.11 36,11.11 v35.03,10.13 | v24.83,10.13 24.48,10.13 23.92,9.57 23.22,9.57 18.05,14.74 17.63,14.74 17.28,15.09 17.28,17.39 17.42,17.53 17.42,19.05 16.28,20.2 16.28,20.53 15.83,20.98 14.85,20.98 6.01,29.82 6.01,29.84 5.73,30.12 5.73,39.43 2.06,43.1 v2.06,58.4
D4  (via drill 0.2)